# EAGLE design power_boardv2 (EAGLE 7.6.0)
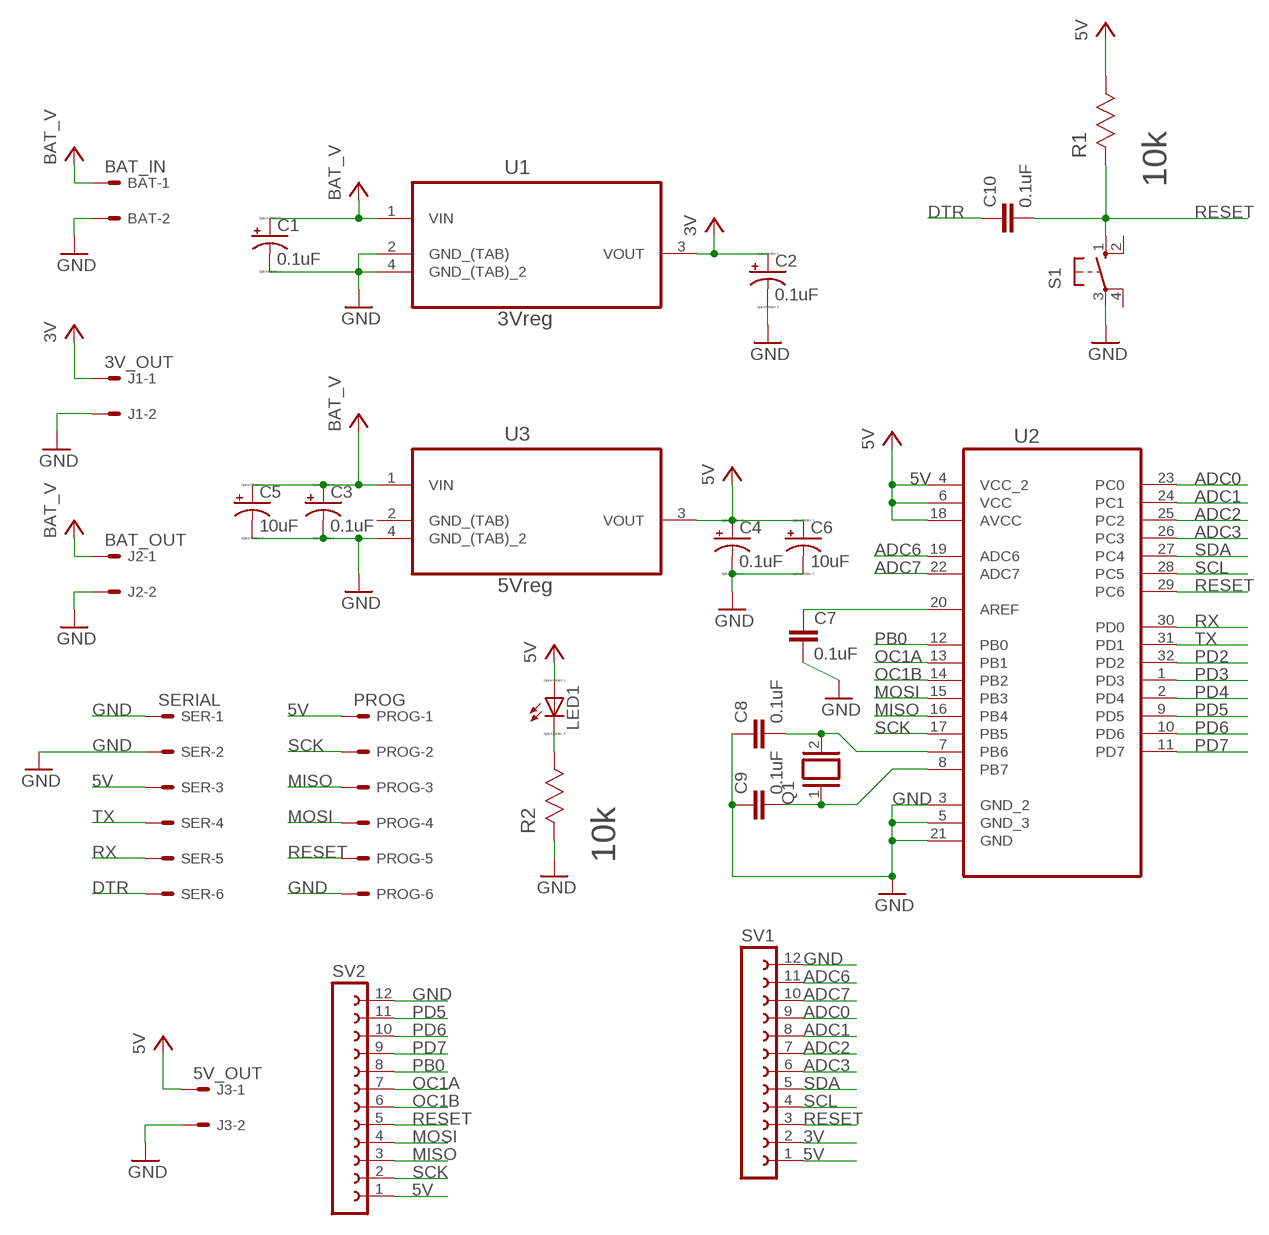
[diagram p0: schematic, sheet 1]

## Parts
BAT  BAT_IN  22-05-7028-02  [7395-02]
C1  0.1uF  CPOL-USE2.5-5  [E2,5-5]
C2  0.1uF  CPOL-USE2.5-5  [E2,5-5]
C3  0.1uF  CPOL-USE2.5-5  [E2,5-5]
C4  0.1uF  CPOL-USE2.5-5  [E2,5-5]
C5  10uF  CPOL-USE2.5-5  [E2,5-5]
C6  10uF  CPOL-USE2.5-5  [E2,5-5]
C7  0.1uF  C2,5-3  [C2.5-3]
C8  0.1uF  C2,5-3  [C2.5-3]
C9  0.1uF  C2,5-3  [C2.5-3]
C10  0.1uF  C2,5-3  [C2.5-3]
J1  3V_OUT  22-05-7028-02  [7395-02]
J2  BAT_OUT  22-05-7028-02  [7395-02]
J3  5V_OUT  22-05-7028-02  [7395-02]
LED1  LED_E  [LED_1206]
PROG  PROG  22-05-7068-06  [7395-06]
Q1  XTAL/S  [QS]
R1  10k  CRCW08051M00JNEA  [RESC2013X65N]
R2  10k  CRCW08051M00JNEA  [RESC2013X65N]
S1  10-XX  [B3F-10XX]
SER  SERIAL  22-05-7068-06  [7395-06]
SV1  FE12-1  [FE12]
SV2  FE12-1  [FE12]
U1  3Vreg  MCP1826S-3302E/DB  [SOT230P700X180-4N]
U2  ATMEGA328P-AU  [QFP80P900X900X120-32N]
U3  5Vreg  MCP1824ST-5002E/DB  [SOT230P700X180-4N]

## Nets
3V: C2.+ J1.1 SV1.2 U1.3(VOUT)
5V: C4.+ C6.+ J3.1 LED1.A PROG.1 R1.1 SER.3 SV1.1 SV2.1 U2.4(VCC_2) U2.6(VCC) U2.18(AVCC) U3.3(VOUT)
ADC0: SV1.9 U2.23(PC0)
ADC1: SV1.8 U2.24(PC1)
ADC2: SV1.7 U2.25(PC2)
ADC3: SV1.6 U2.26(PC3)
ADC6: SV1.11 U2.19(ADC6)
ADC7: SV1.10 U2.22(ADC7)
BAT_V: BAT.1 C1.+ C3.+ C5.+ J2.1 U1.1(VIN) U3.1(VIN)
DTR: C10.1 SER.6
GND: BAT.2 C1.- C2.- C3.- C4.- C5.- C6.- C7.2 C8.1 C9.1 J1.2 J2.2 J3.2 PROG.6 R2.2 S1.3(P) SER.1 SER.2 SV1.12 SV2.12 U1.2(GND_(TAB)) U1.4(GND_(TAB)_2) U2.3(GND_2) U2.5(GND_3) U2.21(GND) U3.4(GND_(TAB)_2)
MISO: PROG.3 SV2.3 U2.16(PB4)
MOSI: PROG.4 SV2.4 U2.15(PB3)
N$1: C7.1 U2.20(AREF)
N$2: C8.2 Q1.2 U2.7(PB6)
N$3: C9.2 Q1.1 U2.8(PB7)
N$4: LED1.C R2.1
OC1A: SV2.7 U2.13(PB1)
OC1B: SV2.6 U2.14(PB2)
PB0: SV2.8 U2.12(PB0)
PD2: U2.32(PD2)
PD3: U2.1(PD3)
PD4: U2.2(PD4)
PD5: SV2.11 U2.9(PD5)
PD6: SV2.10 U2.10(PD6)
PD7: SV2.9 U2.11(PD7)
RESET: C10.2 PROG.5 R1.2 S1.1(S) SV1.3 SV2.5 U2.29(PC6)
RX: SER.5 U2.30(PD0)
SCK: PROG.2 SV2.2 U2.17(PB5)
SCL: SV1.4 U2.28(PC5)
SDA: SV1.5 U2.27(PC4)
TX: SER.4 U2.31(PD1)
Unconnected: S1.2(S1) S1.4(P1) U3.2(GND_(TAB))

## Library data of the parts
BAT J1-J3 = con-molex:22-?-02: CONNECTOR wire to board 2.54 mm (.1 inch) pitch header; OC_FARNELL: 9731601; OC_NEWARK: unknown
C1-C6 = resistor:CPOL-US: POLARIZED CAPACITOR, American symbol
C7-C10 = capacitor-wima:C: CAPACITOR naming: grid - package width
LED1 = eagle-ltspice:LED_E: LED Source: http://www.osram.convergy.de Source: www.luxeon.com Source: www.kingbright.com; SPICEMODEL: NONE; SPICEPREFIX: D; SPICETYPE: diode
PROG SER = con-molex:22-?-06: CONNECTOR wire to board 2.54 mm (.1 inch) pitch header; OC_FARNELL: unknown; OC_NEWARK: unknown
Q1 = special:XTAL/S: CRYSTAL
R1 R2 = Vishay_By_element14_Batch_1:CRCW08051M00JNEA: RESISTOR, 0805; MPN: CRCW08051M00JNEA; OC_FARNELL: 1514803; OC_NEWARK: 59M6845; SUPPLIER: Vishay; TOLERANCE: ± 5.0 %; VALUE: 1M Ohms; WATTAGE: 0.125W
S1 = switch-omron:10-XX: OMRON SWITCH; MPN: B3F-1000; OC_FARNELL: 176432; OC_NEWARK: 36M3542
SV1 SV2 = con-lsta:FE12-1: FEMALE HEADER; OC_FARNELL: unknown; OC_NEWARK: unknown
U1 = Microchip_By_element14_Batch_1:MCP1826S-3302E/DB: IC, LDO, 3.3V, 1A; MPN: MCP1826S-3302E/DB; OC_FARNELL: 1578424; OC_NEWARK: 27M0037; PACKAGE: SOT-223-3; SUPPLIER: Microchip
U2 = Atmel_By_element14_Batch_1-00:ATMEGA328P-AU: 8-bit Microcontroller with In-System Programmable Flash; MPN: ATMEGA328P-AU; OC_FARNELL: 1715486; OC_NEWARK: 14R4631; PACKAGE: TQFP-32; SUPPLIER: Atmel
U3 = Microchip_By_element14_Batch_1:MCP1824ST-5002E/DB: IC, LDO VOLT REG, 5V, 0.3A; MPN: MCP1824ST-5002E/DB; OC_FARNELL: 1578380; OC_NEWARK: 88M9947; PACKAGE: SOT-223-3; SUPPLIER: Microchip

## Board
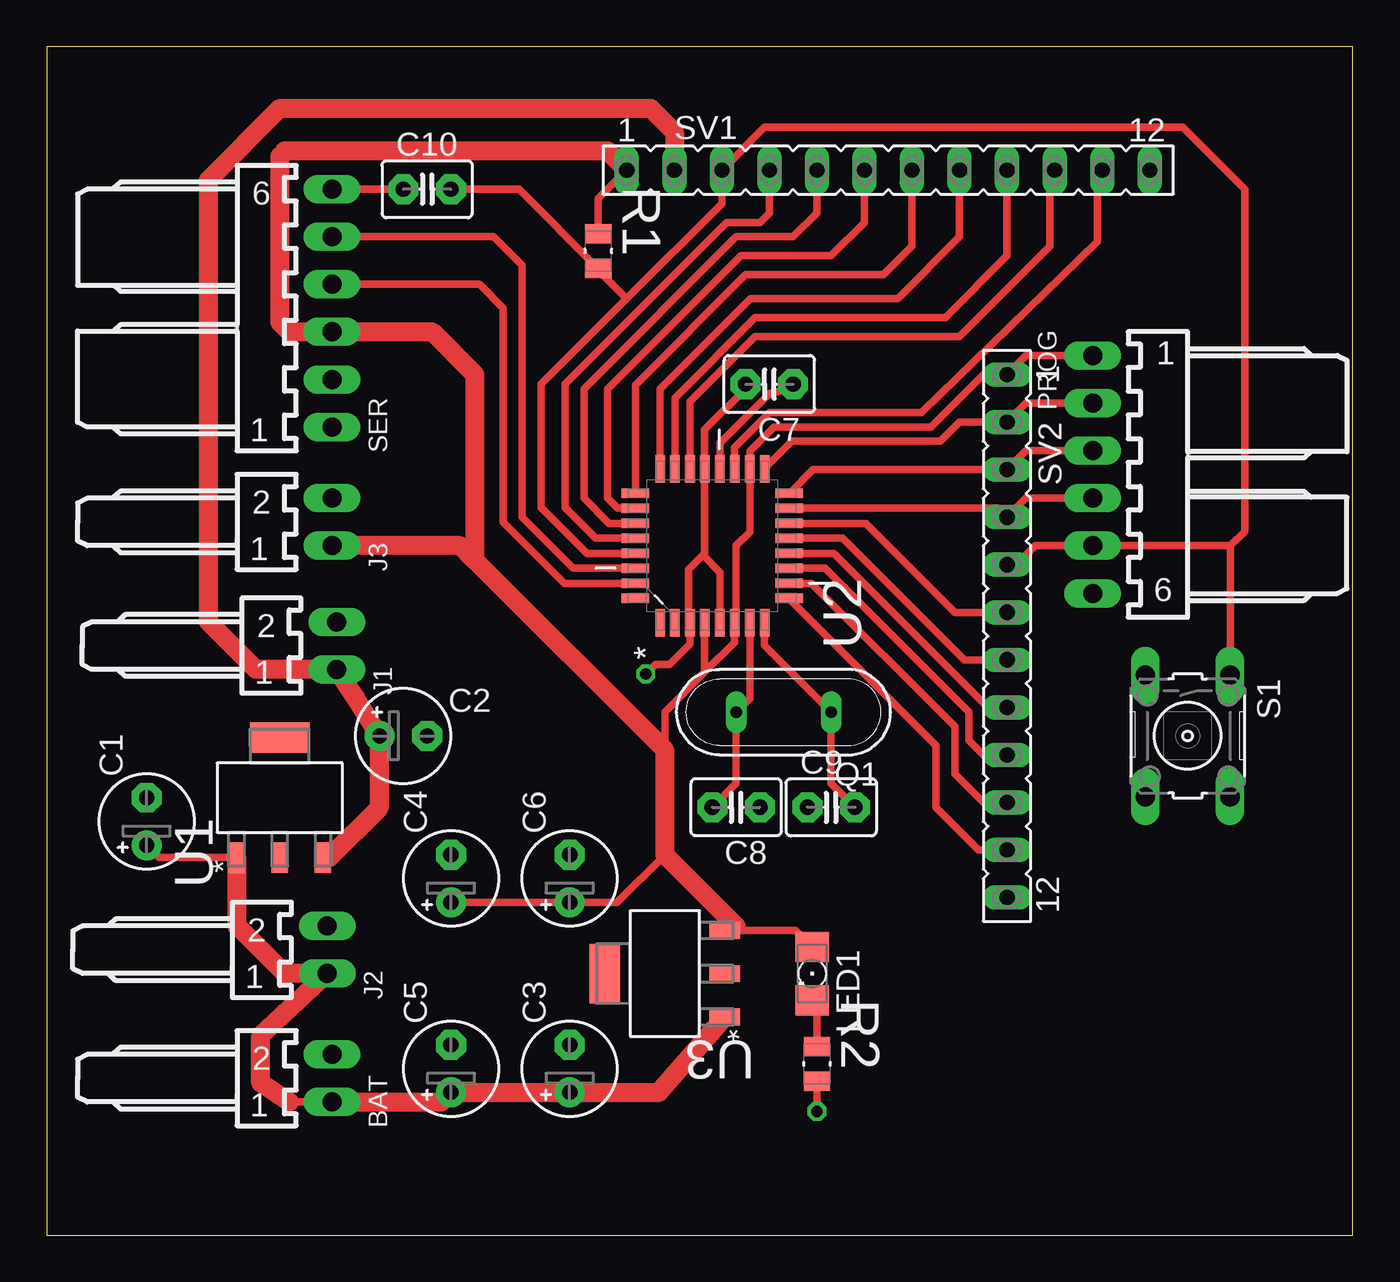
[diagram p1: board, top side]
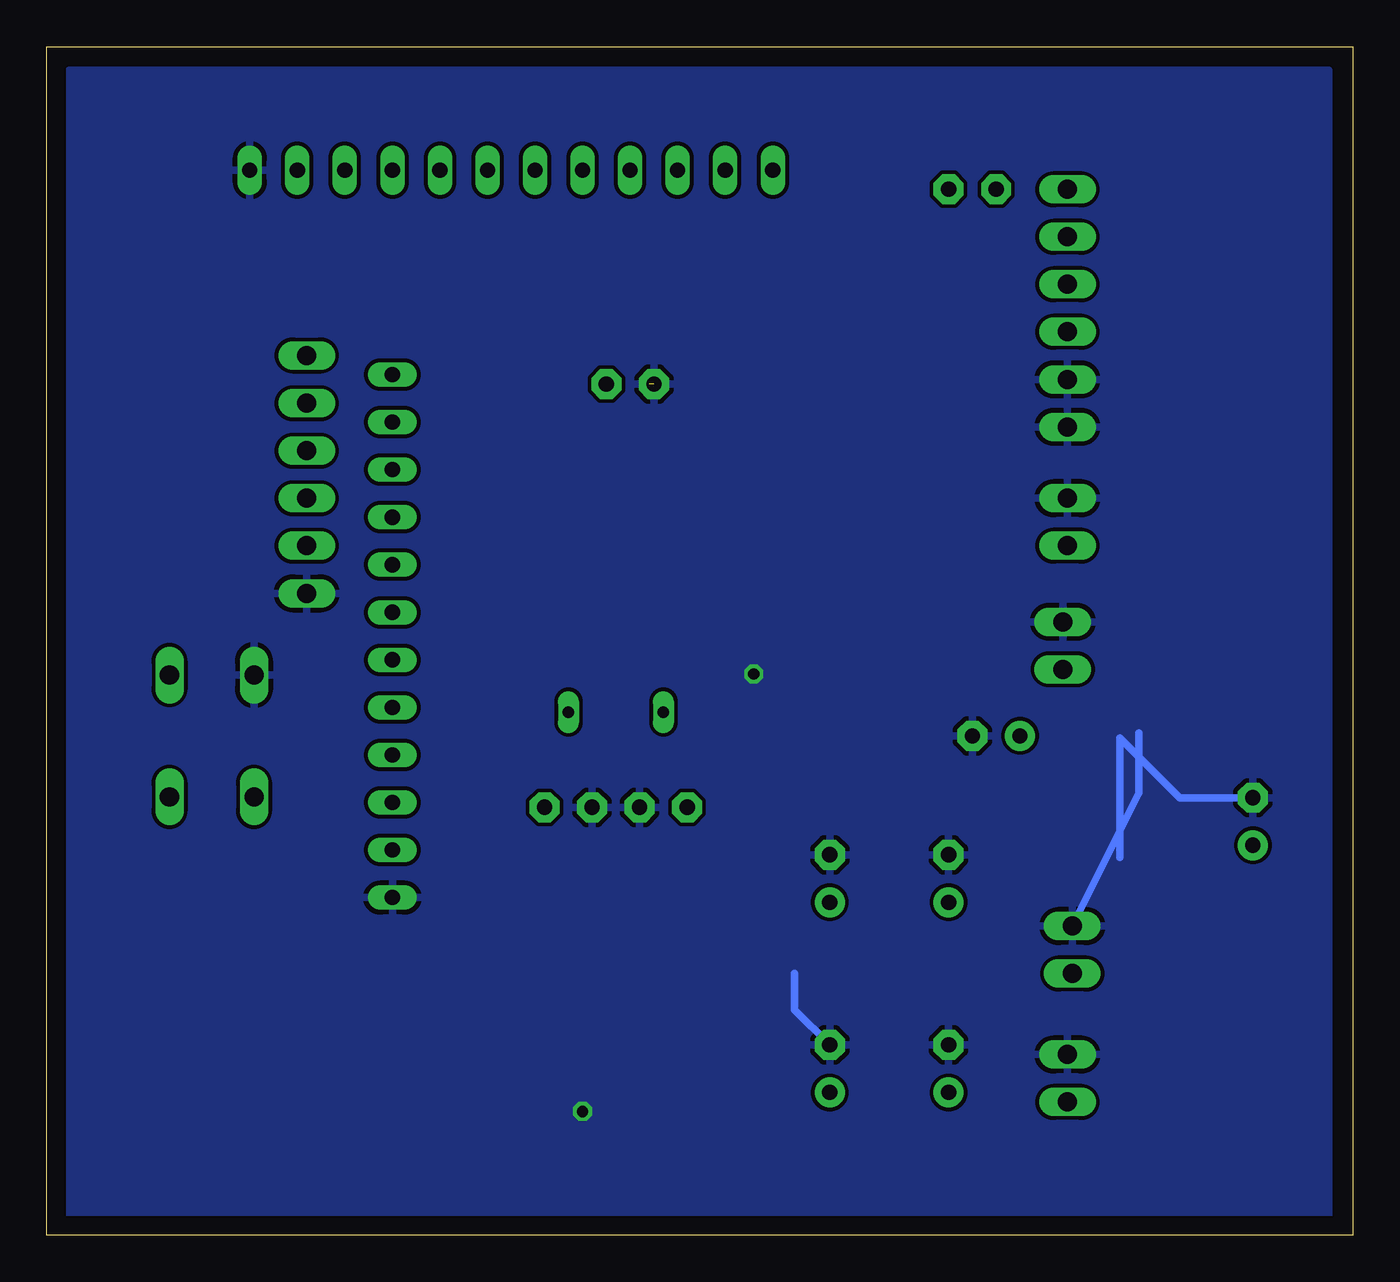
[diagram p2: board, bottom side, seen from below]

Size 69.77 x 63.49 mm. Coordinates in mm from the lower left corner, seen from the top.
Outline: 0,0 69.77,0 69.77,63.49 0,63.49 0,0
Copper layers (1*16): Top 0.035mm / dielectric 1.5mm / Bottom 0.035mm
Design rules "default": minimum track width 10mil, minimum drill 24mil, track to track 8mil, track to pad 8mil, pad to pad 8mil, via to via 8mil, smd to smd 8mil, copper to edge 40mil, drill to drill 8mil, minimum pad ring 10mil, minimum via ring 8mil, stop-mask expansion 4mil, vias tented up to drill 0mil, thermal gap 10mil

### Footprints (pad centres in the part's own frame; a part is rotated, then mirrored left to right if it is on the bottom)
7395-02 = drill 1.016 long: 1 1.27,0; 2 -1.27,0
E2,5-5 = drill 0.813 pad 1.6: + -1.27,0 | drill 0.813 pad 1.6 octagon: - 1.27,0
C2.5-3 = drill 0.813 pad 1.6 octagon: 1 -1.27,0; 2 1.27,0
LED_1206 = smd 1.6 x 1.803: A -1.422,0; C 1.422,0
7395-06 = drill 1.016 long: 1 6.35,0; 2 3.81,0; 3 1.27,0; 4 -1.27,0; 5 -3.81,0; 6 -6.35,0
QS = drill 0.61 long: 1 -2.54,0; 2 2.54,0
RESC2013X65N = smd 1.016 x 1.397: 1 -0.94,0; 2 0.94,0
B3F-10XX = drill 1.016 long: 1 -3.251,2.261; 2 3.251,2.261; 3 -3.251,-2.261; 4 3.251,-2.261
FE12 = drill 0.813 long: 1 -13.97,0; 2 -11.43,0; 3 -8.89,0; 4 -6.35,0; 5 -3.81,0; 6 -1.27,0; 7 1.27,0; 8 3.81,0; 9 6.35,0; 10 8.89,0; 11 11.43,0; 12 13.97,0
SOT230P700X180-4N = smd 1.626 x 0.889: 1 -3.2,2.311; 2 -3.2,0; 3 -3.2,-2.311 | smd 1.626 x 3.175: 4 3.2,0
QFP80P900X900X120-32N = smd 1.473 x 0.508: 1 -4.115,2.794; 2 -4.115,2.007; 3 -4.115,1.194; 4 -4.115,0.406; 5 -4.115,-0.406; 6 -4.115,-1.194; 7 -4.115,-2.007; 8 -4.115,-2.794; 17 4.115,-2.794; 18 4.115,-2.007; 19 4.115,-1.194; 20 4.115,-0.406; 21 4.115,0.406; 22 4.115,1.194; 23 4.115,2.007; 24 4.115,2.794 | smd 0.508 x 1.473: 9 -2.794,-4.115; 10 -2.007,-4.115; 11 -1.194,-4.115; 12 -0.406,-4.115; 13 0.406,-4.115; 14 1.194,-4.115; 15 2.007,-4.115; 16 2.794,-4.115; 25 2.794,4.115; 26 2.007,4.115; 27 1.194,4.115; 28 0.406,4.115; 29 -0.406,4.115; 30 -1.194,4.115; 31 -2.007,4.115; 32 -2.794,4.115

### Placement (x,y rotation side)
BAT  15.24,8.38 270 top
C1  5.33,22.1 90 top
C2  19.05,26.67 0 top
C3  27.94,8.89 90 top
C4  21.59,19.05 90 top
C5  21.59,8.89 90 top
C6  27.94,19.05 90 top
C7  38.61,45.47 180 top
C8  36.83,22.86 180 top
C9  41.91,22.86 0 top
C10  20.32,55.88 0 top
J1  15.49,31.5 270 top
J2  14.99,15.24 270 top
J3  15.24,38.1 270 top
LED1  40.89,13.97 270 top
PROG  55.88,40.64 90 top
Q1  39.37,27.94 180 top
R1  29.46,52.58 270 top
R2  41.15,9.14 270 top
S1  60.96,26.67 270 top
SER  15.24,49.53 270 top
SV1  44.96,56.9 0 top
SV2  51.31,32 270 top
U1  12.45,23.37 90 top
U2  35.56,36.83 90 top
U3  33.02,13.97 180 top

### Tracks (layer width: path | path; a pad name or v marks a point on that pad's centre or on a via)
3V
  Top 0.406: U1.3 15.09,20.17 | SV1.2 33.53,56.64 33.78,56.39 33.78,56.64 SV1.2
  Top 1.016: 15.09,20.17 17.78,22.86 C2.+ 16.51,28.7 J1.1 11.18,30.23 8.64,32.77 8.64,56.39 12.45,60.2 32.26,60.2 33.53,58.93 SV1.2
5V
  Top 0.406: C4.+ C6.+ 30.48,17.78 33.02,20.32 | U2.4 35.15,30.07 | 35.15,30.07 33.02,27.94 33.02,25.91 | 35.15,30.07 36.75,31.67 U2.6 36.83,32.79 36.83,36.83 37.57,37.57 U2.18 37.57,41.88 38.86,43.18 47.24,43.18 50.04,45.97 SV2.1 52.32,46.99 PROG.1 | J3.1 15.24,36.58 | LED1.A 40.01,16.28 36.83,16.28 | 12.7,57.91 12.45,57.66 | R1.1 29.46,55.37 SV1.1 | 36.83,16.51 36.83,16.28 | 36.83,16.28 U3.3
  Top 1.016: 36.83,16.51 33.02,20.32 33.02,25.91 22.86,36.07 | 22.86,36.07 22.1,36.83 J3.1 | 22.86,36.07 22.86,45.97 20.57,48.26 SER.3 12.95,48.26 12.45,48.77 12.45,57.66 | SV1.1 29.97,57.91 12.7,57.91
ADC0
  Top 0.406: U2.23 33.55,44.73 37.85,49.02 48.01,49.02 51.31,52.32 SV1.9
ADC1
  Top 0.406: U2.24 32.77,45.21 37.59,50.04 45.47,50.04 48.77,53.34 SV1.8
ADC2
  Top 0.406: U2.25 31.45,45.41 37.34,51.31 44.7,51.31 46.23,52.83 SV1.7
ADC3
  Top 0.406: U2.26 30.5,38.84 29.97,39.37 29.97,45.21 37.08,52.32 41.91,52.32 43.69,54.1 SV1.6
ADC6
  Top 0.406: U2.19 36.75,42.09 38.61,43.94 46.74,43.94 56.13,53.09 56.13,56.64 SV1.11
ADC7
  Top 0.406: U2.22 34.37,44.53 37.85,48.01 48.77,48.01 53.59,52.83 53.59,56.64 SV1.10
BAT_V
  Top 0.406: 21.08,7.11 C5.+ | BAT.1 12.95,7.11 | 10.16,20.14 U1.1 5.99,20.17 C1.+
  Top 1.016: C5.+ C3.+ 32.69,7.62 U3.1 | BAT.1 21.08,7.11 | 12.95,7.11 11.43,8.13 11.43,10.67 J2.1 12.7,13.97 10.16,16.51 10.16,20.14
DTR
  Top 0.406: SER.6 C10.1
GND  (via drill 0.6)  (4 unrouted)
  Top 0.406: 35.05,36.32 35.15,36.42 U2.21 35.15,43.03 37.59,45.47 | 35.05,36.32 34.29,35.56 34.29,33.27 | U2.5 35.97,35.41 35.05,36.32 | 34.37,32.33 U2.3 34.37,31.57 33.27,30.48 32.51,30.48 v32,29.97 | v41.15,6.6 R2.2
  Bottom 0.406: J2.2 11.43,23.62 11.43,26.82 | C3.- 29.82,12.04 U3.4 | U1.2 U1.4 9.25,23.37 C1.-
  pour Bottom: 1.27,62.23 68.58,62.23 68.58,0 1.27,0
MISO
  Top 0.406: PROG.3 52.32,41.91 SV2.3 40.95,40.89 U2.16
MOSI
  Top 0.406: PROG.4 52.32,39.37 SV2.4 50.83,38.84 U2.15
N$1
  Top 0.406: U2.20 35.97,42.32 38.61,44.96 39.62,45.21 C7.1
N$2
  Top 0.406: U2.7 37.57,28.68 Q1.2 36.83,24.13 C8.2
N$3
  Top 0.406: U2.8 38.35,31.5 Q1.1 41.91,24.13 C9.2
N$4
  Top 0.406: R2.1 41.15,12.29 LED1.C
OC1A
  Top 0.406: U2.13 42.52,37.24 49.02,30.73 SV2.7
OC1B
  Top 0.406: U2.14 43.76,38.02 48.51,33.27 SV2.6
PB0
  Top 0.406: U2.12 42.06,36.42 50.29,28.19 SV2.8
PD5
  Top 0.406: U2.9 39.67,33.98 47.5,26.16 47.5,22.86 49.78,20.57 SV2.11
PD6
  Top 0.406: U2.10 40.87,34.82 48.51,27.18 48.51,24.64 50.04,23.11 SV2.10
PD7
  Top 0.406: U2.11 41.58,35.64 49.28,27.94 49.28,26.42 50.29,25.4 51.05,25.4 SV2.9
RESET
  Top 0.406: U2.29 28.85,36.42 26.42,38.86 26.42,45.47 30.99,50.04 | 30.99,50.04 36.07,55.12 SV1.3 38.35,59.18 60.71,59.18 64.01,55.88 64.01,37.59 63.25,36.83 | C10.2 25.22,55.88 R1.2 29.46,51.56 30.99,50.04 | SV2.5 51.82,35.81 52.83,36.83 PROG.5 63.25,36.83 | 63.25,36.83 63.25,29.95 S1.1
RX
  Top 0.406: U2.30 28.12,35.64 25.4,38.35 25.4,51.82 23.88,53.34 SER.5
SCK
  Top 0.406: PROG.2 52.32,44.45 SV2.2 48.77,43.43 47.75,42.42 39.83,42.42 U2.17
SCL
  Top 0.406: U2.28 29.31,37.24 27.69,38.86 27.69,45.47 36.32,54.1 38.1,54.1 38.61,54.61 SV1.4
SDA
  Top 0.406: U2.27 30.05,38.02 28.7,39.37 28.7,45.21 36.83,53.34 39.88,53.34 41.15,54.61 41.15,56.13 40.89,56.39 40.89,56.64 SV1.5
TX
  Top 0.406: U2.31 27.66,34.82 24.38,38.1 24.38,49.53 23.11,50.8 SER.4